# Altium schematic sheet 压力传感器.SchDoc
size A4; SheetNumber: 6; SheetTotal: 14
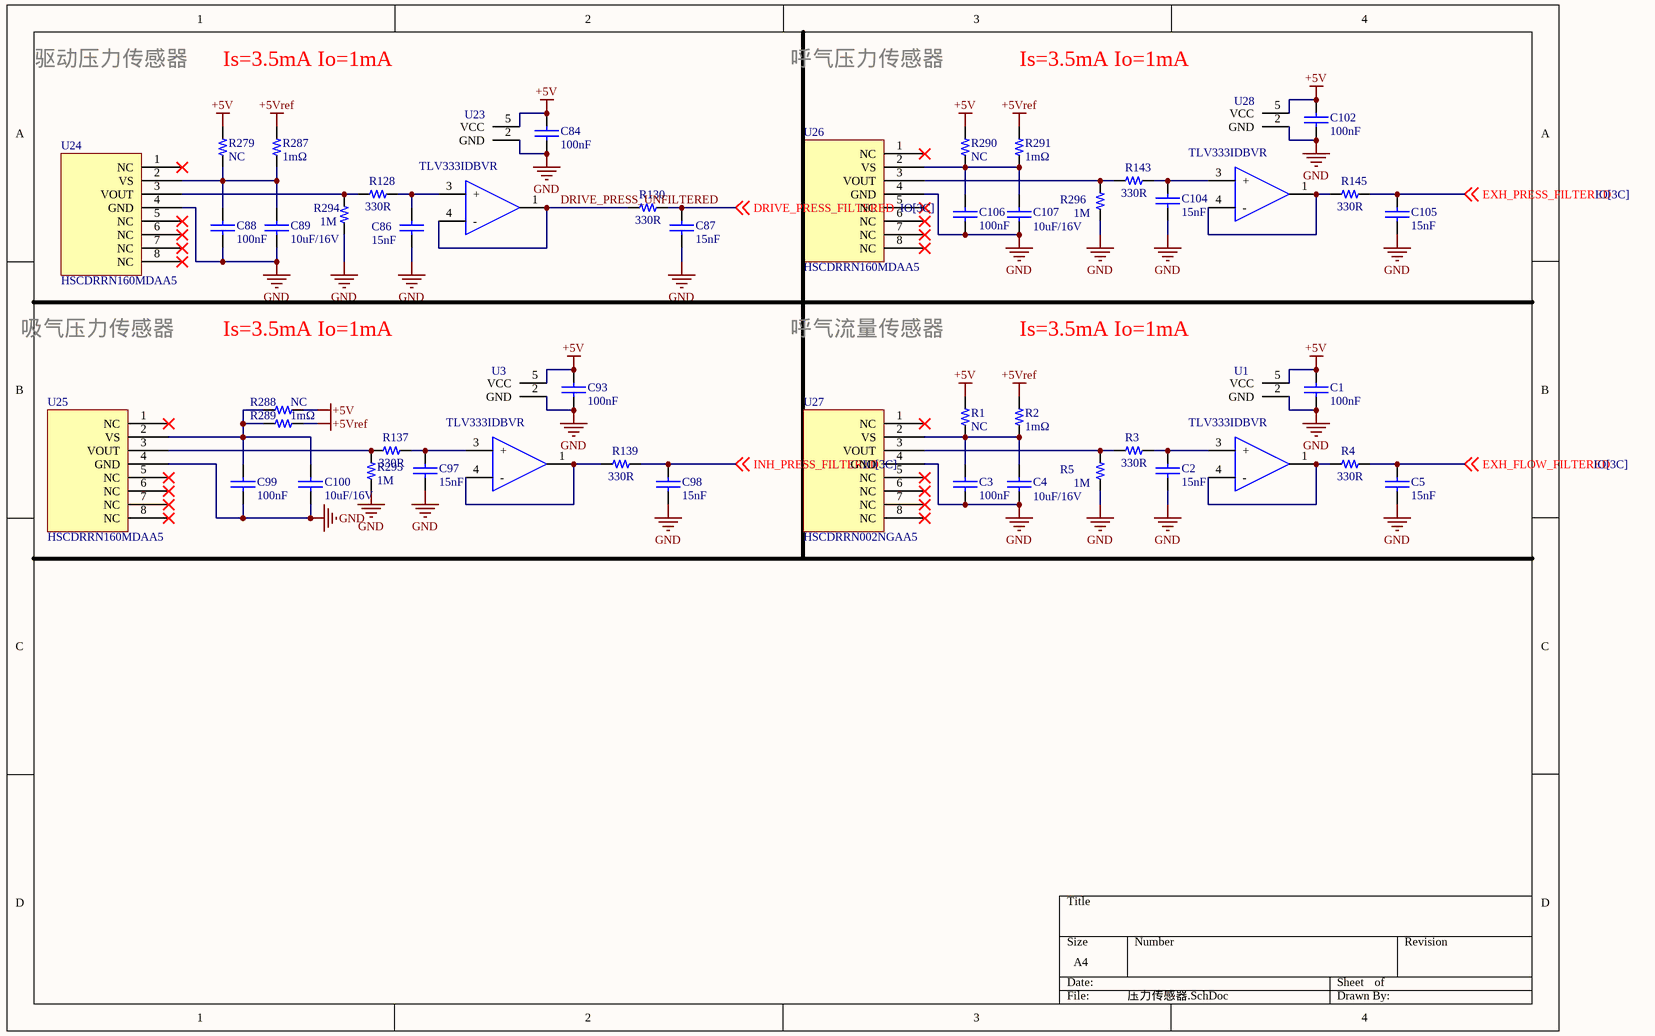
[diagram p0: 压力传感器.SchDoc]

## Parts
C1  100nF  [C-0603]
C2  15nF  [C-0603]
C3  100nF  [C-0603]
C4  10uF/16V  [C-0805]
C5  15nF  [C-0603]
C84  100nF  [C-0603]
C86  15nF  [C-0603]
C87  15nF  [C-0603]
C88  100nF  [C-0603]
C89  10uF/16V  [C-0805]
C93  100nF  [C-0603]
C97  15nF  [C-0603]
C98  15nF  [C-0603]
C99  100nF  [C-0603]
C100  10uF/16V  [C-0805]
C102  100nF  [C-0603]
C104  15nF  [C-0603]
C105  15nF  [C-0603]
C106  100nF  [C-0603]
C107  10uF/16V  [C-0805]
R1  NC  [R-0603]
R2  1mΩ  [R-0603]
R3  330R  [R-0603]
R4  330R  [R-0603]
R5  1M  [R-0603]
R128  330R  [R-0603]
R130  330R  [R-0603]
R137  330R  [R-0603]
R139  330R  [R-0603]
R143  330R  [R-0603]
R145  330R  [R-0603]
R279  NC  [R-0603]
R287  1mΩ  [R-0603]
R288  NC  [R-0603]
R289  1mΩ  [R-0603]
R290  NC  [R-0603]
R291  1mΩ  [R-0603]
R294  1M  [R-0603]
R295  1M  [R-0603]
R296  1M  [R-0603]
U1  TLV333IDBVR  [SOT23-5]
U3  TLV333IDBVR  [SOT23-5]
U23  TLV333IDBVR  [SOT23-5]
U24  HSCDRRN160MDAA5  [SSCDRR]
U25  HSCDRRN160MDAA5  [SSCDRR]
U26  HSCDRRN160MDAA5  [SSCDRR]
U27  HSCDRRN002NGAA5  [SSCDRR]
U28  TLV333IDBVR  [SOT23-5]

## Nets
+5V: C1.2 C84.2 C93.2 C102.2 R1.1 R279.1 R288.1 R290.1 U1.5(VCC) U3.5(VCC) U23.5(VCC) U28.5(VCC)
+5Vref: R2.1 R287.1 R289.1 R291.1
GND: C1.1 C2.1 C3.1 C4.1 C5.1 C84.1 C86.1 C87.1 C88.1 C89.1 C93.1 C97.1 C98.1 C99.1 C100.1 C102.1 C104.1 C105.1 C106.1 C107.1 R5.2 R294.2 R295.2 R296.2 U1.2(GND) U3.2(GND) U23.2(GND) U24.4(GND) U25.4(GND) U26.4(GND) U27.4(GND) U28.2(GND)
DRIVE_PRESS_FILTERED: C87.2 R130.1 ; off-sheet DRIVE_PRESS_FILTERED
DRIVE_PRESS_UNFILTERED: R130.2 U23.1 U23.4(-)
EXH_FLOW_FILTERED: C5.2 R4.1 ; off-sheet EXH_FLOW_FILTERED
EXH_PRESS_FILTERED: C105.2 R145.1 ; off-sheet EXH_PRESS_FILTERED
INH_PRESS_FILTERED: C98.2 R139.1 ; off-sheet INH_PRESS_FILTERED
NetC2_2: C2.2 R3.1 U1.3(+)
NetC3_2: C3.2 C4.2 R1.2 R2.2 U27.2(VS)
NetC86_2: C86.2 R128.1 U23.3(+)
NetC88_2: C88.2 C89.2 R279.2 R287.2 U24.2(VS)
NetC97_2: C97.2 R137.1 U3.3(+)
NetC99_2: C99.2 C100.2 R288.2 R289.2 U25.2(VS)
NetC104_2: C104.2 R143.1 U28.3(+)
NetC106_2: C106.2 C107.2 R290.2 R291.2 U26.2(VS)
NetR3_2: R3.2 R5.1 U27.3(VOUT)
NetR4_2: R4.2 U1.1 U1.4(-)
NetR128_2: R128.2 R294.1 U24.3(VOUT)
NetR137_2: R137.2 R295.1 U25.3(VOUT)
NetR139_2: R139.2 U3.1 U3.4(-)
NetR143_2: R143.2 R296.1 U26.3(VOUT)
NetR145_2: R145.2 U28.1 U28.4(-)

Not connected (* = marked no-connect by the designer): U24 1(NC)* 5(NC)* 6(NC)* 7(NC)* 8(NC)*; U25 1(NC)* 5(NC)* 6(NC)* 7(NC)* 8(NC)*; U26 1(NC)* 5(NC)* 6(NC)* 7(NC)* 8(NC)*; U27 1(NC)* 5(NC)* 6(NC)* 7(NC)* 8(NC)*

## Notes on the sheet
- 驱动压力传感器
- Is=3.5mA Io=1mA
- 呼气压力传感器
- 吸气压力传感器
- 呼气流量传感器

## Library data of the parts
C1-C5 C84 C86-C89 C93 C97-C100 C102 C104-C107 = CAP: Capacitor
R1-R5 R128 R130 R137 R139 R143 R145 R279 R287-R291 R294-R296 = R-0603
U1 U3 U23 U28 = TLV333IDBVR: 品牌：TI，型号：TLV333IDBVR,SOIC-8,–25°~+85°C,单运放，ROHS
U24-U27 = SSCMJJ010KDAA5